# Altium schematic sheet SC942C_STORRB.SchDoc: Sorties TOR Relais Bistable
size 393 x 270 mm; CompanyName: Seccom; Address1: 521, rue du capt. François Garbit; Address2: 69440 Mornant; Address3: seccom@seccom.fr; Address4: www.seccom.fr; DocumentNumber: 7; SheetNumber: 7; SheetTotal: 8; PageSetup: Record=PageOptions|CenterHorizontal=True|CenterVertical=True|PrintScale=0.74|XCorrection=1.00|YCorrection=1.00|PrintKind=0|BorderSize=5000000|LeftOffset=0|BottomOffset=0|Orientation=2|PaperLength=1000|PaperWidth=1000|Scale=100|PaperSource=7|PrintQuality=-4|MediaType=1|DitherType=10|PaperKind=A4|PrintScaleMode=1
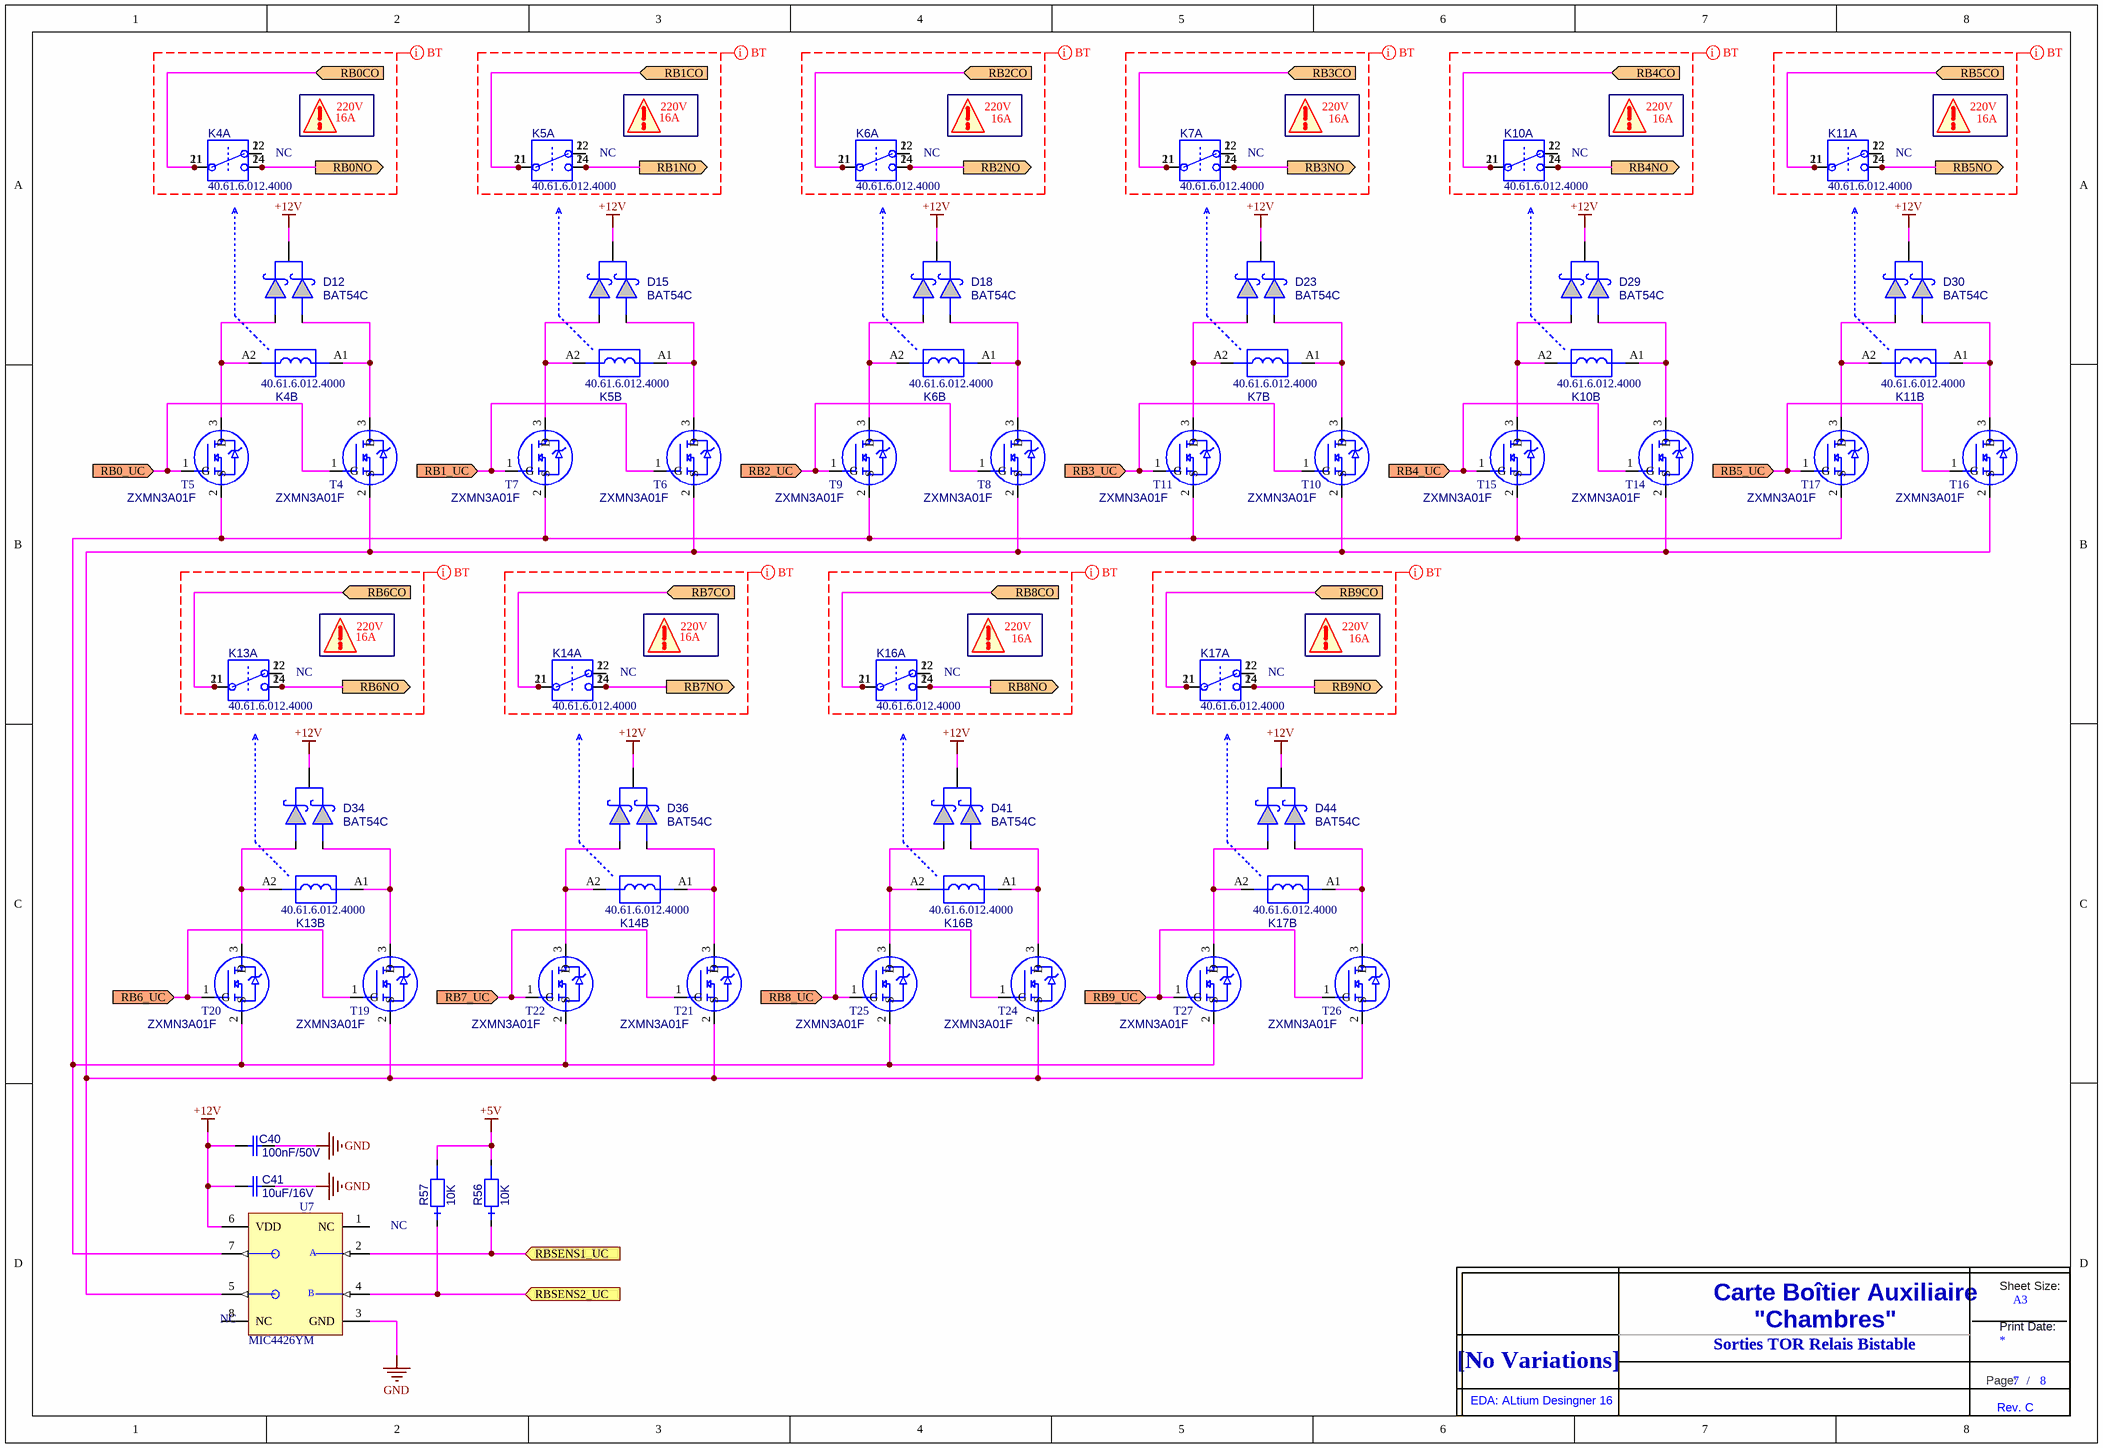
[diagram p0: SC942C_STORRB.SchDoc]

## Parts
C40  value 100nF/50V  [0805_ReflowSoldering_CAP]  (hidden comment: C_0805_X7R_10%_100N-50V)
C41  value 10uF/16V  [0805_ReflowSoldering_CAP]  (hidden comment: C_0805_X5R_10%_10U-16V)
D12  BAT54C  [SOT23_3L_ReflowSoldering]
D15  BAT54C  [SOT23_3L_ReflowSoldering]
D18  BAT54C  [SOT23_3L_ReflowSoldering]
D23  BAT54C  [SOT23_3L_ReflowSoldering]
D29  BAT54C  [SOT23_3L_ReflowSoldering]
D30  BAT54C  [SOT23_3L_ReflowSoldering]
D34  BAT54C  [SOT23_3L_ReflowSoldering]
D36  BAT54C  [SOT23_3L_ReflowSoldering]
D41  BAT54C  [SOT23_3L_ReflowSoldering]
D44  BAT54C  [SOT23_3L_ReflowSoldering]
K4  value 40.61.6.012.4000  [RELAY_FINDER_40.61_+SUPPORT_95]  (hidden comment: RELAY_12VDC_1RT_BI_40.61.6)  (parts A,B of 2)
K5  value 40.61.6.012.4000  [RELAY_FINDER_40.61_+SUPPORT_95]  (hidden comment: RELAY_12VDC_1RT_BI_40.61.6)  (parts A,B of 2)
K6  value 40.61.6.012.4000  [RELAY_FINDER_40.61_+SUPPORT_95]  (hidden comment: RELAY_12VDC_1RT_BI_40.61.6)  (parts A,B of 2)
K7  value 40.61.6.012.4000  [RELAY_FINDER_40.61_+SUPPORT_95]  (hidden comment: RELAY_12VDC_1RT_BI_40.61.6)  (parts A,B of 2)
K10  value 40.61.6.012.4000  [RELAY_FINDER_40.61_+SUPPORT_95]  (hidden comment: RELAY_12VDC_1RT_BI_40.61.6)  (parts A,B of 2)
K11  value 40.61.6.012.4000  [RELAY_FINDER_40.61_+SUPPORT_95]  (hidden comment: RELAY_12VDC_1RT_BI_40.61.6)  (parts A,B of 2)
K13  value 40.61.6.012.4000  [RELAY_FINDER_40.61_+SUPPORT_95]  (hidden comment: RELAY_12VDC_1RT_BI_40.61.6)  (parts A,B of 2)
K14  value 40.61.6.012.4000  [RELAY_FINDER_40.61_+SUPPORT_95]  (hidden comment: RELAY_12VDC_1RT_BI_40.61.6)  (parts A,B of 2)
K16  value 40.61.6.012.4000  [RELAY_FINDER_40.61_+SUPPORT_95]  (hidden comment: RELAY_12VDC_1RT_BI_40.61.6)  (parts A,B of 2)
K17  value 40.61.6.012.4000  [RELAY_FINDER_40.61_+SUPPORT_95]  (hidden comment: RELAY_12VDC_1RT_BI_40.61.6)  (parts A,B of 2)
R56  value 10K  [0805_ReflowSoldering_RES]  (hidden comment: RES_0805_1%_100PPM_10K)
R57  value 10K  [0805_ReflowSoldering_RES]  (hidden comment: RES_0805_1%_100PPM_10K)
T4  ZXMN3A01F  [SOT23_3L_ReflowSoldering]
T5  ZXMN3A01F  [SOT23_3L_ReflowSoldering]
T6  ZXMN3A01F  [SOT23_3L_ReflowSoldering]
T7  ZXMN3A01F  [SOT23_3L_ReflowSoldering]
T8  ZXMN3A01F  [SOT23_3L_ReflowSoldering]
T9  ZXMN3A01F  [SOT23_3L_ReflowSoldering]
T10  ZXMN3A01F  [SOT23_3L_ReflowSoldering]
T11  ZXMN3A01F  [SOT23_3L_ReflowSoldering]
T14  ZXMN3A01F  [SOT23_3L_ReflowSoldering]
T15  ZXMN3A01F  [SOT23_3L_ReflowSoldering]
T16  ZXMN3A01F  [SOT23_3L_ReflowSoldering]
T17  ZXMN3A01F  [SOT23_3L_ReflowSoldering]
T19  ZXMN3A01F  [SOT23_3L_ReflowSoldering]
T20  ZXMN3A01F  [SOT23_3L_ReflowSoldering]
T21  ZXMN3A01F  [SOT23_3L_ReflowSoldering]
T22  ZXMN3A01F  [SOT23_3L_ReflowSoldering]
T24  ZXMN3A01F  [SOT23_3L_ReflowSoldering]
T25  ZXMN3A01F  [SOT23_3L_ReflowSoldering]
T26  ZXMN3A01F  [SOT23_3L_ReflowSoldering]
T27  ZXMN3A01F  [SOT23_3L_ReflowSoldering]
Title_new?  DNI  (value not drawn)  (graphical)
U7  MIC4426YM  [SOIC_08_E1,27_L150_ReflowSoldering]

## Ports
RB0_UC (in), RB0CO (in), RB0NO (out), RB1_UC (in), RB1CO (in), RB1NO (out), RB2_UC (in), RB2CO (in), RB2NO (out), RB3_UC (in), RB3CO (in), RB3NO (out), RB4_UC (in), RB4CO (in), RB4NO (out), RB5_UC (in), RB5CO (in), RB5NO (out), RB6_UC (in), RB6CO (in), RB6NO (out), RB7_UC (in), RB7CO (in), RB7NO (out), RB8_UC (in), RB8CO (in), RB8NO (out), RB9_UC (in), RB9CO (in), RB9NO (out), RBSENS1_UC (in), RBSENS2_UC (in)

## Nets
+5V: R56.2 R57.2
+12V: C40.1 C41.2 D12.3 D15.3 D18.3 D23.3 D29.3 D30.3 D34.3 D36.3 D41.3 D44.3 U7.6(VDD)
GND: C40.2 C41.1 U7.3(GND)
RB0_UC: T4.1(G) T5.1(G) ; port RB0_UC
RB0CO: K4.11(COM) K4.21(COM) ; port RB0CO
RB0NO: K4.14(NO) K4.24(NO) ; port RB0NO
RB1_UC: T6.1(G) T7.1(G) ; port RB1_UC
RB1CO: K5.11(COM) K5.21(COM) ; port RB1CO
RB1NO: K5.14(NO) K5.24(NO) ; port RB1NO
RB2_UC: T8.1(G) T9.1(G) ; port RB2_UC
RB2CO: K6.11(COM) K6.21(COM) ; port RB2CO
RB2NO: K6.14(NO) K6.24(NO) ; port RB2NO
RB3_UC: T10.1(G) T11.1(G) ; port RB3_UC
RB3CO: K7.11(COM) K7.21(COM) ; port RB3CO
RB3NO: K7.14(NO) K7.24(NO) ; port RB3NO
RB4_UC: T14.1(G) T15.1(G) ; port RB4_UC
RB4CO: K10.11(COM) K10.21(COM) ; port RB4CO
RB4NO: K10.14(NO) K10.24(NO) ; port RB4NO
RB5_UC: T16.1(G) T17.1(G) ; port RB5_UC
RB5CO: K11.11(COM) K11.21(COM) ; port RB5CO
RB5NO: K11.14(NO) K11.24(NO) ; port RB5NO
RB6_UC: T19.1(G) T20.1(G) ; port RB6_UC
RB6CO: K13.11(COM) K13.21(COM) ; port RB6CO
RB6NO: K13.14(NO) K13.24(NO) ; port RB6NO
RB7_UC: T21.1(G) T22.1(G) ; port RB7_UC
RB7CO: K14.11(COM) K14.21(COM) ; port RB7CO
RB7NO: K14.14(NO) K14.24(NO) ; port RB7NO
RB8_UC: T24.1(G) T25.1(G) ; port RB8_UC
RB8CO: K16.11(COM) K16.21(COM) ; port RB8CO
RB8NO: K16.14(NO) K16.24(NO) ; port RB8NO
RB9_UC: T26.1(G) T27.1(G) ; port RB9_UC
RB9CO: K17.11(COM) K17.21(COM) ; port RB9CO
RB9NO: K17.14(NO) K17.24(NO) ; port RB9NO
RBSENS1_UC: R56.1 U7.2(INA) ; port RBSENS1_UC
RBSENS2_UC: R57.1 U7.4(INB) ; port RBSENS2_UC
NetD12_1: D12.1 K4.A1 T4.3(D)
NetD12_2: D12.2 K4.A2 T5.3(D)
NetD15_1: D15.1 K5.A1 T6.3(D)
NetD15_2: D15.2 K5.A2 T7.3(D)
NetD18_1: D18.1 K6.A1 T8.3(D)
NetD18_2: D18.2 K6.A2 T9.3(D)
NetD23_1: D23.1 K7.A1 T10.3(D)
NetD23_2: D23.2 K7.A2 T11.3(D)
NetD29_1: D29.1 K10.A1 T14.3(D)
NetD29_2: D29.2 K10.A2 T15.3(D)
NetD30_1: D30.1 K11.A1 T16.3(D)
NetD30_2: D30.2 K11.A2 T17.3(D)
NetD34_1: D34.1 K13.A1 T19.3(D)
NetD34_2: D34.2 K13.A2 T20.3(D)
NetD36_1: D36.1 K14.A1 T21.3(D)
NetD36_2: D36.2 K14.A2 T22.3(D)
NetD41_1: D41.1 K16.A1 T24.3(D)
NetD41_2: D41.2 K16.A2 T25.3(D)
NetD44_1: D44.1 K17.A1 T26.3(D)
NetD44_2: D44.2 K17.A2 T27.3(D)
NetK4_12: K4.12(NC) K4.22(NC)
NetK5_12: K5.12(NC) K5.22(NC)
NetK6_12: K6.12(NC) K6.22(NC)
NetK7_12: K7.12(NC) K7.22(NC)
NetK10_12: K10.12(NC) K10.22(NC)
NetK11_12: K11.12(NC) K11.22(NC)
NetK13_12: K13.12(NC) K13.22(NC)
NetK14_12: K14.12(NC) K14.22(NC)
NetK16_12: K16.12(NC) K16.22(NC)
NetK17_12: K17.12(NC) K17.22(NC)
NetT4_2: T4.2(S) T6.2(S) T8.2(S) T10.2(S) T14.2(S) T16.2(S) T19.2(S) T21.2(S) T24.2(S) T26.2(S) U7.5(~{OUTB})
NetT5_2: T5.2(S) T7.2(S) T9.2(S) T11.2(S) T15.2(S) T17.2(S) T20.2(S) T22.2(S) T25.2(S) T27.2(S) U7.7(~{OUTA})

Not connected (* = marked no-connect by the designer): U7 1(NC) 8(NC)

## Layout directives
net class BT: (no net found under the mark)

## Notes on the sheet
- 16A
- 220V
- (near K4) NC
- (near K5) NC
- (near K6) NC
- (near K7) NC
- (near K10) NC
- (near K11) NC
- (near K13) NC
- (near K14) NC
- (near K16) NC
- (near K17) NC
- NC
- (near U7) NC
- Sorties TOR Relais Bistable
- (in symbol MIC4426YM) A; B
- (in symbol Title_new_1) Sheet Size:; Carte Boîtier Auxiliaire; A3; "Chambres"; Print Date:; [No Variations]; Page:; /; EDA: ALtium Desingner 16; Rev. C

## Library data of the parts
C40 = C_0805_X7R_10%_100N-50V: Condensateur céramique, X7R, 10%, CMS 0805; Creation: LJ; Verification: LJ (28/05/04); Reference: 000042/00; Boitier: 0805; Remarque: {Remarque}; Fabricant: AVX; Ref Fab: 08055C104KAT2A; Coeff: 1; ComponentLink1URL: o:\_Documentation\Datasheets\BC_Components\Condo_CMS_NPO-X7R-Y5V.pdf; ComponentLink2URL: o:\_Documentation\Datasheets\_BOITIERS\PASSIF_CMS\RC_0805_(2x1,25)_(Schneider).PDF; Config: *; ComponentLink1Description: Datasheet; ComponentLink2Description: Datasheet Boitier; Supplier 1: Farnell; Supplier Part Number 1: 499687
C41 = C_0805_X5R_10%_10U-16V: Condensateur céramique, X5R, 10%, CMS 0805; Creation: LJ (12/09/11); Reference: 001715/00; Boitier: 0805; Remarque: {Remarque}; Coeff: 1; Fabricant: Murata; Ref Fab: GRM219R61C106KA73D; Verification: *; ComponentLink1URL: o:\_Documentation\Datasheets\; ComponentLink2URL: o:\_Documentation\Datasheets\_Boitiers\PASSIF_CMS\RC_0805_(2x1,25)_(Schneider).pdf; Config: *; ComponentLink1Description: Datasheet; ComponentLink2Description: Datasheet Boitier
D12 D15 D18 D23 D29 D30 D34 D36 D41 D44 = BAT54C: Diode Schottky double, BAT54 cathode com, Vrrm=30V, If=300mA, Vf=0.4Vmax, CMS; Creation: LJ (14/05/02); Reference: 000597/00; Boitier: SOT23_3L; Remarque: {Remarque}; Fabricant: NXP; Coeff: 1; Verification: LJ (14/05/02); Ref Fab: BAT54C; ComponentLink1URL: o:\_Documentation\Datasheets\NXP\BAT54_series.pdf; ComponentLink2URL: o:\_Documentation\Datasheets\_BOITIERS\ACTIF_CMS\SOT\SOT_23_3P_(Schneider).PDF; Config: *; ComponentLink1Description: Datasheet; ComponentLink2Description: Datasheet Boitier; Value: BAT54C; Supplier 1: Farnell; Supplier Part Number 1: 1081192
K4-K7 K10 K11 K13 K14 K16 K17 = RELAY_12VDC_1RT_BI_40.61.6: Relais 1RT, 12Vdc, série 40.61.6 (bistable), Rc=900R, Sw:250Vac/16A, Ron=? (AgSnO2); Creation: CHD; Verification: LJ (24/11/11); Boitier: type DIP16; Remarque: {Remarque}; Fabricant: Finder; Coeff: 1; Ref Fab: 40.61.6.012.4000; ComponentLink1URL: o:\_Documentation\Datasheets\Finder\Relais_Serie_40.pdf; ComponentLink2URL: o:\_Documentation\Datasheets\_BOITIERS\; Config: *; ComponentLink1Description: Datasheet; ComponentLink2Description: Datasheet Boitier
R56 R57 = RES_0805_1%_100PPM_10K: Résistance CMS 0805, 0.125W, 1%, 100ppm, 150V; Creation: LJ (06/02/09); Reference: 000063/00; Boitier: 0805; Remarque: {Remarque}; Fabricant: Yageo; Ref Fab: RC0805FR-0710KL; Coeff: 1; Verification: *; ComponentLink1URL: o:\_Documentation\Datasheets\BC_Components\Resistances_ThickFilmFlatChip_0402-0603-0805-1206.pdf; ComponentLink2URL: o:\_Documentation\Datasheets\_BOITIERS\PASSIF_CMS\RC_0805_(2x1,25)_(Schneider).PDF; Config: *; ComponentLink1Description: Datasheet; ComponentLink2Description: Datasheet Boitier; Supplier 1: Farnell; Supplier Part Number 1: 9237755
T4-T11 T14-T17 T19-T22 T24-T27 = ZXMN3A01F: Transistor MOSN logique, Vdss=30V, Id=2A, Rdson=0.12R, CMS; Boitier: SOT23_3L; Remarque: {Remarque}; Creation: CHD; Fabricant: Zetex; Coeff: 1; Ref Fab: ZXMN3A01F; ComponentLink1URL: o:\_Documentation\Datasheets\; ComponentLink2URL: o:\_Documentation\Datasheets\_BOITIERS\ACTIF_CMS\SOT\SOT_23_3P_(Schneider).PDF; Config: *; ComponentLink1Description: Datasheet; Value: ZXMN3A01F; Supplier 1: Farnell; Supplier 2: Mouser; Supplier Part Number 1: 9525734; Supplier Part Number 2: 522-ZXMN3A01FTA
Title_new? = Title_new_1
U7 = MIC4426YM: Dual High-Speed 1.5A MOSFET Driver, CMS; Creation: CHD; Verification: LJ (); Boitier: SO8_L150; Remarque: {Remarque}; Fabricant: Micrel; Coeff: 1; Ref Fab: MIC4426YM; ComponentLink1URL: o:\_Documentation\Datasheets\; ComponentLink2URL: o:\_Documentation\Datasheets\_Boitiers\ACTIF_CMS\SOIC\SOIC_08_e1,27_L150_(Schneider).PDF; Config: *; ComponentLink1Description: Datasheet; ComponentLink2Description: Datasheet Boitier; Value: MIC4426YM